# EAGLE schematic Temp controlled fan (EAGLE 8.4.1)
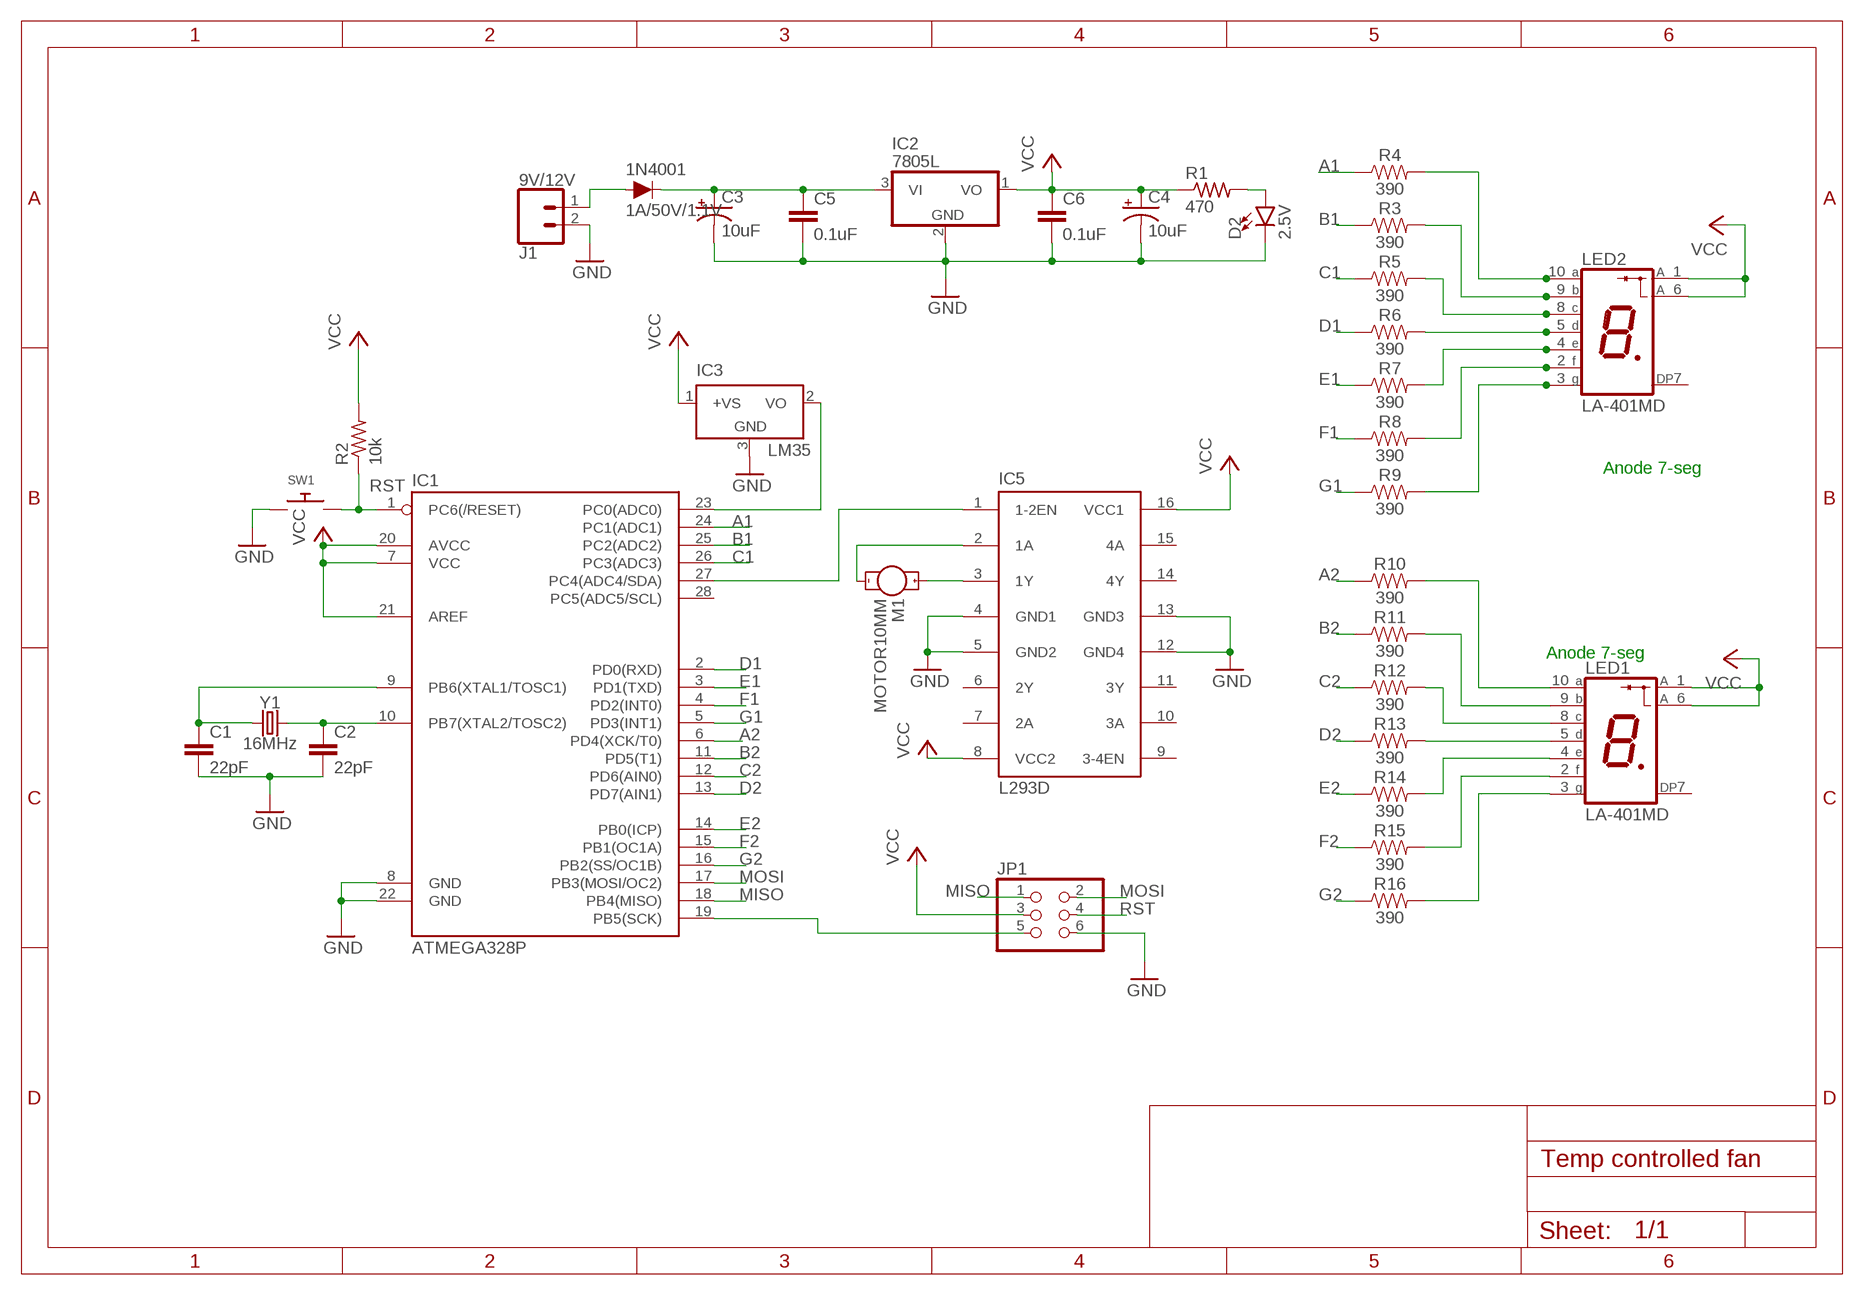
[diagram p0: schematic, sheet 1]

## Parts
1N4001  1A/50V/1.1V  DIODE-PTH  [DIODE-1N4001]
C1  22pF  22PF-0603-50V-5%  [0603]
C2  22pF  22PF-0603-50V-5%  [0603]
C3  10uF  10UF-POLAR-RADIAL-2.5MM-25V-20%  [CPOL-RADIAL-2.5MM-5MM]
C4  10uF  10UF-POLAR-RADIAL-2.5MM-25V-20%  [CPOL-RADIAL-2.5MM-5MM]
C5  0.1uF  0.1UF-0603-25V-5%  [0603]
C6  0.1uF  0.1UF-0603-25V-5%  [0603]
D2  2.5V  LED1206  [LED-1206]
IC1  ATMEGA328P  ATMEGA328P_PDIP  [DIP28]
IC2  7805L  [TO92]
IC3  LM35  LM35CZ  [TO92]
IC5  L293D  [DIL16]
J1  9V/12V  CONN_02PTH_RA_FEMALE  [1X02_RA_PTH_FEMALE]
JP1  PINHD-2X3  [2X03]
LED1  LA-401MD  [LA-401]
LED2  LA-401MD  [LA-401]
M1  MOTOR10MM  [VIBE-MOTOR-10MM]
R1  470  R-US_R1206  [R1206]
R2  10k  R-US_R1206  [R1206]
R3  390  RESISTOR0805  [0805]
R4  390  RESISTOR0805  [0805]
R5  390  RESISTOR0805  [0805]
R6  390  RESISTOR0805  [0805]
R7  390  RESISTOR0805  [0805]
R8  390  RESISTOR0805  [0805]
R9  390  RESISTOR0805  [0805]
R10  390  RESISTOR0805  [0805]
R11  390  RESISTOR0805  [0805]
R12  390  RESISTOR0805  [0805]
R13  390  RESISTOR0805  [0805]
R14  390  RESISTOR0805  [0805]
R15  390  RESISTOR0805  [0805]
R16  390  RESISTOR0805  [0805]
SW1  SWITCH_PUSHBUTTONSOFTTOUCHSMD_SJ  [PUSHBUTTON_SMD_SJ]
Y1  16MHz  CRYSTAL-16MHZPTH-HC49US  [HC49US]

## Nets
A1: IC1.24(PC1(ADC1)) R4.1
A2: IC1.6(PD4(XCK/T0)) R10.1
B1: IC1.25(PC2(ADC2)) R3.1
B2: IC1.11(PD5(T1)) R11.1
C1: IC1.26(PC3(ADC3)) R5.1
C2: IC1.12(PD6(AIN0)) R12.1
D1: IC1.2(PD0(RXD)) R6.1
D2: IC1.13(PD7(AIN1)) R13.1
E1: IC1.3(PD1(TXD)) R7.1
E2: IC1.14(PB0(ICP)) R14.1
F1: IC1.4(PD2(INT0)) R8.1
F2: IC1.15(PB1(OC1A)) R15.1
G1: IC1.5(PD3(INT1)) R9.1
G2: IC1.16(PB2(SS/OC1B)) R16.1
GND: C1.2 C2.2 C3.2(-) C4.2(-) C5.2 C6.2 D2.C IC1.8(GND) IC1.22(GND) IC2.2(GND) IC3.3(GND) IC5.4(GND1) IC5.5(GND2) IC5.12(GND4) IC5.13(GND3) J1.2 JP1.6 SW1.P$1
MISO: IC1.18(PB4(MISO)) JP1.1
MOSI: IC1.17(PB3(MOSI/OC2)) JP1.2
N$1: C2.1 IC1.10(PB7(XTAL2/TOSC2)) Y1.2
N$3: C1.1 IC1.9(PB6(XTAL1/TOSC1)) Y1.1
N$4: IC1.23(PC0(ADC0)) IC3.2(VO)
N$5: D2.A R1.2
N$6: 1N4001.A J1.1
N$7: 1N4001.C C3.1(+) C5.1 IC2.3(VI)
N$8: LED2.10(A) R4.2
N$9: LED2.9(B) R3.2
N$10: IC1.27(PC4(ADC4/SDA)) IC5.1(1-2EN)
N$11: LED2.8(C) R5.2
N$12: LED2.5(D) R6.2
N$13: LED2.3(G) R9.2
N$14: LED2.2(F) R8.2
N$15: LED2.4(E) R7.2
N$16: LED1.10(A) R10.2
N$17: LED1.9(B) R11.2
N$18: LED1.8(C) R12.2
N$19: LED1.5(D) R13.2
N$20: LED1.3(G) R16.2
N$21: LED1.2(F) R15.2
N$22: LED1.4(E) R14.2
N$23: IC5.2(1A) M1.-
N$24: IC5.3(1Y) M1.+
N$37: IC1.19(PB5(SCK)) JP1.5
RST: IC1.1(PC6(/RESET)) JP1.4 R2.1 SW1.P$2
VCC: C4.1(+) C6.1 IC1.7(VCC) IC1.20(AVCC) IC1.21(AREF) IC2.1(VO) IC3.1(+VS) IC5.8(VCC2) IC5.16(VCC1) JP1.3 LED1.1(A) LED1.6(A) LED2.1(A) LED2.6(A) R1.1 R2.2
Unconnected: IC1.28(PC5(ADC5/SCL)) IC5.6(2Y) IC5.7(2A) IC5.9(3-4EN) IC5.10(3A) IC5.11(3Y) IC5.14(4Y) IC5.15(4A) LED1.7(DP) LED2.7(DP)

## Notes on the sheet
- Anode 7-seg
- Anode 7-seg

## Library data of the parts
1N4001 = SparkFun-DiscreteSemi:DIODE: Diode These are standard reverse protection diodes and small signal diodes. SparkFun Products: SparkFun SparkPunk Sound Kit <https://www.sparkfun.com/products/11177> SparkFun ESP8266 Thing <https://www.sparkfun.com/products/13231>; PROD_ID: DIO-09176
C1 C2 = SparkFun-Capacitors:22PF: 22pF ceramic capacitors A capacitor is a passive two-terminal electrical component used to store electrical energy temporarily in an electric field.; PROD_ID: CAP-07876
C3 C4 = SparkFun-Capacitors:10UF-POLAR: 10.0µF polarized capacitors A capacitor is a passive two-terminal electrical component used to store electrical energy temporarily in an electric field.; PROD_ID: CAP-08440
C5 C6 = SparkFun-Capacitors:0.1UF: 0.1µF ceramic capacitors A capacitor is a passive two-terminal electrical component used to store electrical energy temporarily in an electric field.; PROD_ID: CAP-08604
D2 = SparkFun-LED:LED: LED (Generic) Standard schematic elements and footprints for 5mm, 3mm, 1206, and 0603 sized LEDs. Generic LEDs with no color specified.
IC1 = SparkFun-IC-Microcontroller:ATMEGA328P_PDIP: Atmel 328P Through hole ATMEGA328P uC used in the Arduino 32kb flash, 1k EEPROM, 2k SRAM Datasheet <http://www.sparkfun.com/datasheets/Components/SMD/ATMega328.pdf> SparkFun Products Storefront component: AVR 28 Pin 20MHz 32K 6A/D - ATMega328P <https://www.sparkfun.com/products/9061> (COM-09061) SparkFun Simon Says - Through-Hole Soldering Kit <https://www.sparkfun.com/products/10547> (KIT-10547) SparkFun Learn to Solder - Simon Says <https://www.sparkfun.com/products/13708> (KIT-13708) SparkFun BigTime Watch Kit <https://www.sparkfun.com/products/11734> (KIT-11734) SparkFun ClockIt <https://www.sparkfun.com/products/10930> (KIT-10930) SparkFun Serial Enabled LCD Kit <https://www.sparkfun.com/products/10097> (LCD-10097) SparkFun Simon Tilts - Through Hole Soldering Kit <https://www.sparkfun.com/products/12634> (KIT-12634) SparkFun Frequency Counter Kit <https://www.sparkfun.com/products/10140> (KIT-10140) FabFM Radio Kit <https://www.sparkfun.com/products/11043> (KIT-11043) SparkFun Binary Blaster Kit <https://www.sparkfun.com/products/12037> (KIT-12037) SparkFun Metro-Gnome <https://www.sparkfun.com/products/9236> (KIT-09236) ATmega328 with Arduino Optiboot (Uno) <https://www.sparkfun.com/products/10524> (DEV-10524); PROD_ID: IC-09136; VALUE: 328P
IC2 = adafruit:78*: Positive VOLTAGE REGULATOR Added bigger pads to the TO-92 package
IC3 = lm35:LM35: Single-Supply Centigrade Temperature Sensor Vout = (10mV/°C x Temp °C) +5mmmV Source: http://www.national.com/ds/LM/LM35.pdf
IC5 = st-microelectronics:L293D: PUSH-PULL 4 CHANNEL DRIVER
J1 = SparkFun-Connectors:CONN_02: Multi connection point. Often used as Generic Header-pin footprint for 0.1 inch spaced/style header connections On any of the 0.1 inch spaced packages, you can populate with these: Break Away Headers - Straight <https://www.sparkfun.com/products/116> (PRT-00116) Break Away Male Headers - Right Angle <https://www.sparkfun.com/products/553> (PRT-00553) Female Headers <https://www.sparkfun.com/products/115> (PRT-00115) Break Away Headers - Machine Pin <https://www.sparkfun.com/products/117> (PRT-00117) Break Away Female Headers - Swiss Machine Pin <https://www.sparkfun.com/products/743> (PRT-00743) For SCREWTERMINALS and SPRING TERMINALS visit here: Screw Terimnals on SparkFun.com <https://www.sparkfun.com/search/results?term=Screw+Terminals> (5mm/3.5mm/2.54mm spacing) This device is also useful as a general connection point to wire up your design to another part of your project. Our various solder wires solder well into these plated through hole pads. Hook-Up Wire - Assortment (Stranded, 22 AWG) <https://www.sparkfun.com/products/11375> (PRT-11375) Hook-Up Wire - Assortment (Solid Core, 22 AWG) <https://www.sparkfun.com/products/11367> (PRT-11367) View the entire wire category on our website here <https://www.sparkfun.com/categories/141> Special notes: Molex polarized connector foot print use with: PRT-08233 with associated crimp pins and housings. 2.54_SCREWTERM for use with PRT-10571. 3.5mm Screw Terminal footprints for PRT-08084 5mm Screw Terminal footprints for use with PRT-08432; PROD_ID: CONN-13700
JP1 = pinhead:PINHD-2X3: PIN HEADER
LED1 LED2 = led-7-segment:LA-401*D: Single Digit LED Numeric Display (anode common) Source: ROHM .. la-1401dn.pdf; OC_FARNELL: unknown; OC_NEWARK: unknown
M1 = SparkFun-Electromechanical:MOTOR: Motor (Single-Phase) Two-terminal, single-phase motors. SparkFun Products Vibration Motor <https://www.sparkfun.com/products/8449> (ROB-08449) Physical dimension and wire connections for this powerful vibration motor. Motor has a self adhesive backing.; PROD_ID: COMP-08572; SF_SKU: ROB-08449
R1 R2 = resistor:R-US_: RESISTOR, American symbol
R3-R16 = SparkFun-Resistors:RESISTOR: Generic Resistor Package
SW1 = adafruit:SWITCH_PUSHBUTTON: Buttons SOFTTOUCHSMD_SJ - Soft touch temporary push button (Super Junk Akihabara) Compatible with SKPMANE010 [Mouser: 688-SKPMAN] C&K_KSS = Digikey: KSS221GLFS
Y1 = SparkFun-Clocks:CRYSTAL-16MHZ: 16MHz Crystal Digikey Example <http://www.digikey.com/product-search/en?keywords=535-9122-1-ND> Frequency: 16MHz Frequency Stability: ±50ppm Frequency Tolerance: ±20ppm Load Capacitance: 18pF SparkFun Products: Pro Micro -5V/16MHz <https://www.sparkfun.com/products/12640> SparkFun Serial Enabled LCD Kit <https://www.sparkfun.com/products/10097>; PROD_ID: XTAL-08181; SF_ID: COM-00536